# Altium schematic sheet CLKB_analog_phase_detector.SchDoc
size A
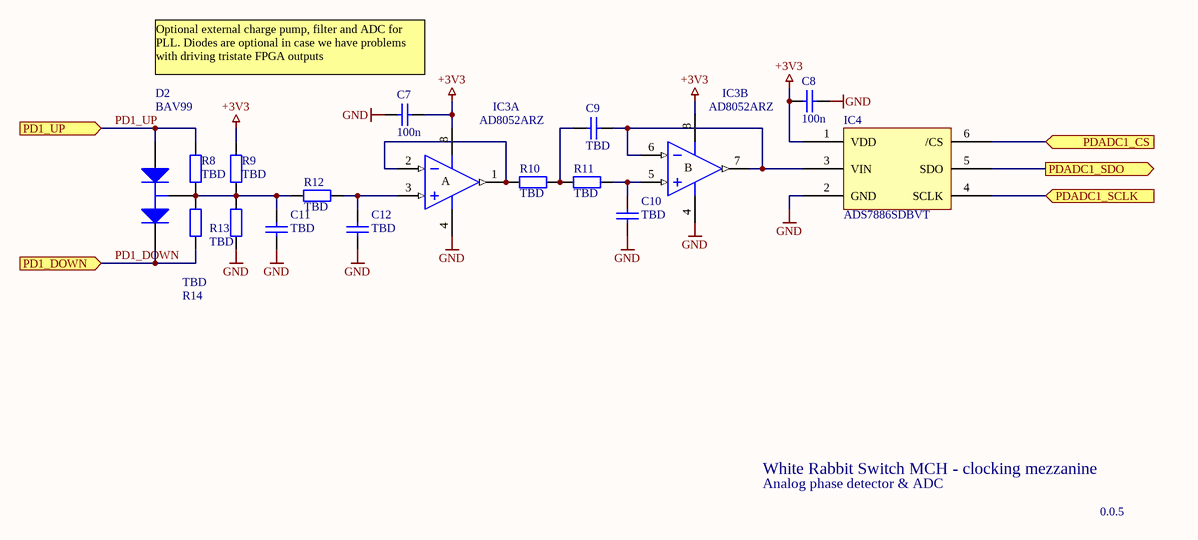
[diagram p0: CLKB_analog_phase_detector.SchDoc]

## Parts
C7  value 100n  [CAPC1608X87N]  (hidden comment: *)
C8  value 100n  [CC1608-0603]  (hidden comment: *)
C9  value TBD  [CAPC1608X87N]  (hidden comment: *)
C10  value TBD  [CAPC1608X87N]  (hidden comment: *)
C11  value TBD  [CAPC1608X87N]  (hidden comment: *)
C12  value TBD  [CAPC1608X87N]  (hidden comment: *)
D2  value BAV99  [SOT-23]  (hidden comment: BAV99*)
IC3  value AD8052ARZ  [SOIC127P600-8AL]  (hidden comment: AD8052*)  (parts A,B of 2)
IC4  value ADS7886SDBVT  [SOT23A-6L]  (hidden comment: ADS7886*)
R8  value TBD  [RESC1608X55N]  (hidden comment: *)
R9  value TBD  [RESC1608X55N]  (hidden comment: *)
R10  value TBD  [RESC1608X55N]  (hidden comment: *)
R11  value TBD  [RESC1608X55N]  (hidden comment: *)
R12  value TBD  [RESC1608X55N]  (hidden comment: *)
R13  value TBD  [RESC1608X55N]  (hidden comment: *)
R14  value TBD  [RESC1608X55N]  (hidden comment: *)

## Ports
PD1_DOWN (in), PD1_UP (in), PDADC1_CS (in), PDADC1_SCLK (in), PDADC1_SDO (out)

## Nets
+3V3: C7.1 C8.1 IC3.8(V+) IC4.1(VDD) R9.2
GND: C7.2 C8.2 C10.1 C11.1 C12.1 IC3.4(V-) IC4.2(GND) R13.1
PD1_DOWN: D2.2(K) R14.1 ; port PD1_DOWN
PD1_UP: D2.1(A) R8.2 ; port PD1_UP
PDADC1_CS: IC4.6(/CS) ; port PDADC1_CS
PDADC1_SCLK: IC4.4(SCLK) ; port PDADC1_SCLK
PDADC1_SDO: IC4.5(SDO) ; port PDADC1_SDO
NetC9_1: C9.1 IC3.6(IN-) IC3.7(OUT) IC4.3(VIN)
NetC9_2: C9.2 R10.2 R11.1
NetC10_2: C10.2 IC3.5(IN+) R11.2
NetC11_2: C11.2 D2.3(C) R8.1 R9.1 R12.1 R13.2 R14.2
NetC12_2: C12.2 IC3.3(IN+) R12.2
NetIC3_1: IC3.1(OUT) IC3.2(IN-) R10.1

## Notes on the sheet
- (near C7) Optional external charge pump, filter and ADC for PLL. Diodes are optional in case we have problems with driving tristate FPGA outputs
- White Rabbit Switch MCH - clocking mezzanine
- Analog phase detector & ADC
- 0.0.5
- (in symbol AD8052, part A) A
- (in symbol AD8052, part B) B

## Library data of the parts
C7-C12 = Cap: Capacitor; Published: 8-Jun-2000; Revision: July-2002: Re-released for DXP Platform.; Publisher: Altium Limited
D2 = BAV99: Silicon Switching Diode Array for High-Speed Switching; RefId: 1081211; Published: 21-Mar-2003; DatasheetDocument: Oct-1999; PackageDocument: Sep-2001; PackageReference: SOT-23; Publisher: Altium Limited; ComponentLink1Description: Manufacturer Link; ComponentLink1URL: http://www.infineon.com/; ComponentLink2Description: Datasheet; ComponentLink2URL: http://www.infineon.com/upload/Document/cmc_upload/documents/080/631/bav99series_1.pdf; Supplier: Farnell
IC3 = AD8052: Low Cost, High-Speed Rail-to-Rail Amplifier; Package Information: Latest Revision: 1997; RefId: 9425616; Published: 8-Jun-2000; Revision: 17-Jul-2002: Re-released for DXP Platform.; Datasheet: Latest Revision: REV. A 1999; Package Reference: RM-08; Publisher: Altium Limited; Supplier: Farnell
IC4 = ADS7886: TI 1 MSPS serial ADC; RefId: 1575257; Supplier: Farnell
R8-R14 = Res2: Resistor; Published: 8-Jun-2000; Revision: July-2002: Re-released for DXP Platform.; Publisher: Altium Limited